# Altium schematic sheet Block Diagram.SchDoc: Block Diagram
size B; CompanyName: Cospan Design; DrawnBy: David McCoy; Engineer: David McCoy; DocumentNumber: 1; SheetNumber: 1; SheetTotal: 8
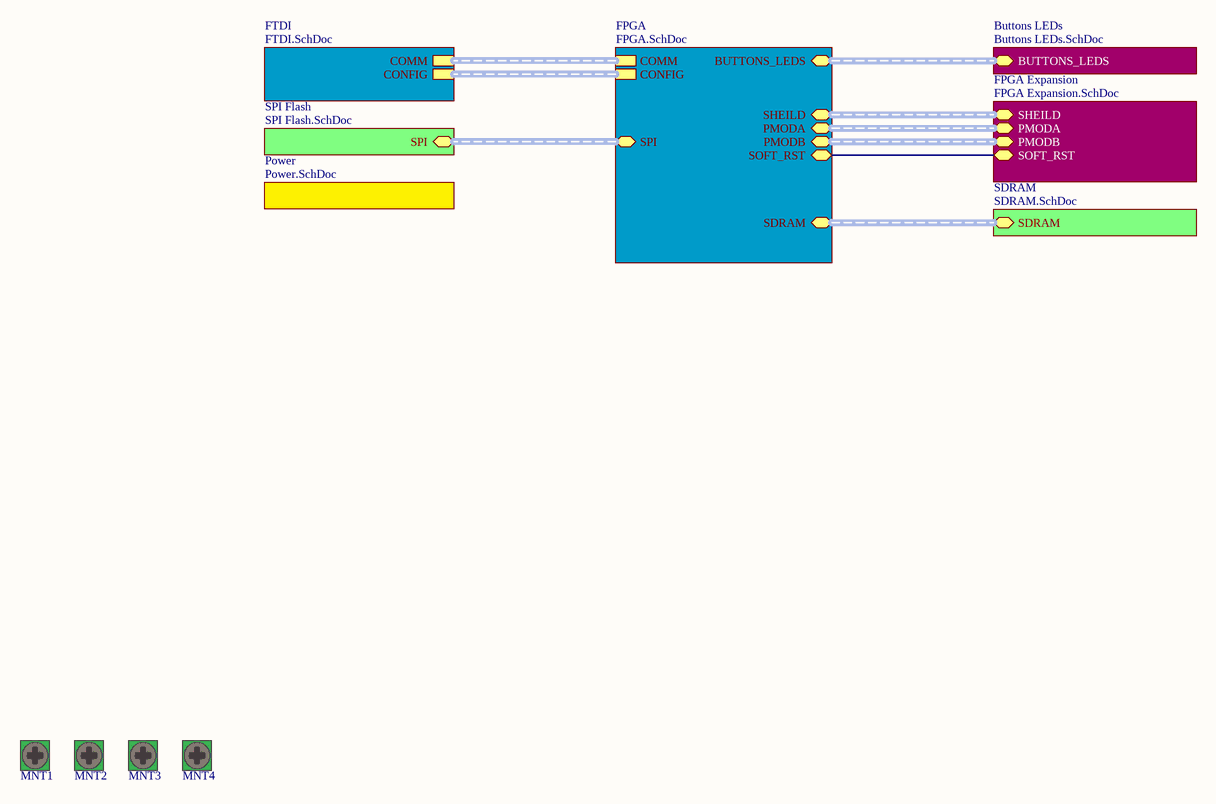
[diagram p0: Block Diagram.SchDoc]

## Parts
MNT1  Mounting Hole  [MNT_4-40]  (value not drawn)  (no BOM)
MNT2  Mounting Hole  [MNT_4-40]  (value not drawn)  (no BOM)
MNT3  Mounting Hole  [MNT_4-40]  (value not drawn)  (no BOM)
MNT4  Mounting Hole  [MNT_4-40]  (value not drawn)  (no BOM)

## Sub-sheets
Buttons LEDs = Buttons LEDs.SchDoc: BUTTONS_LEDS (harness BUTTON_LED_Harness)
FPGA = FPGA.SchDoc: COMM (harness COMM_Harness), CONFIG (harness CONFIG_Harness), BUTTONS_LEDS (harness BUTTON_LED_Harness), SHEILD (harness SHIELD_Harness), PMODA (harness PMOD_Harness), PMODB (harness PMOD_Harness), SDRAM (harness SDRAM_Harness), SPI (harness SPI_Harness), SOFT_RST
FPGA Expansion = FPGA Expansion.SchDoc: SHEILD (harness SHIELD_Harness), PMODA (harness PMOD_Harness), PMODB (harness PMOD_Harness), SOFT_RST
FTDI = FTDI.SchDoc: COMM (harness COMM_Harness), CONFIG (harness CONFIG_Harness)
Power = Power.SchDoc: no entries
SDRAM = SDRAM.SchDoc: SDRAM (harness SDRAM_Harness)
SPI Flash = SPI Flash.SchDoc: SPI (harness SPI_Harness)

## Nets
(unnamed): sheet FPGA/SOFT_RST, sheet FPGA Expansion/SOFT_RST

## Buses and harness runs
harness sheet Buttons LEDs/BUTTONS_LEDS = sheet FPGA/BUTTONS_LEDS
harness sheet FPGA Expansion/PMODA = sheet FPGA/PMODA
harness sheet FPGA Expansion/PMODB = sheet FPGA/PMODB
harness sheet FPGA Expansion/SHEILD = sheet FPGA/SHEILD
harness sheet FPGA/COMM = sheet FTDI/COMM
harness sheet FPGA/CONFIG = sheet FTDI/CONFIG
harness sheet FPGA/SDRAM = sheet SDRAM/SDRAM
harness sheet FPGA/SPI = sheet SPI Flash/SPI

## Notes on the sheet
- Title:
- http://www.cospandesign.com
- Cospan Design
- Project:
- Document:
- Engineer:
- Drawn By:
- Approved By:
- Revision:
- Date:
- Number:
- of

## Library data of the parts
MNT1-MNT4 = MNT_440_HOLE